# EAGLE design 3.3V_StepDown (EAGLE 9.5.1)
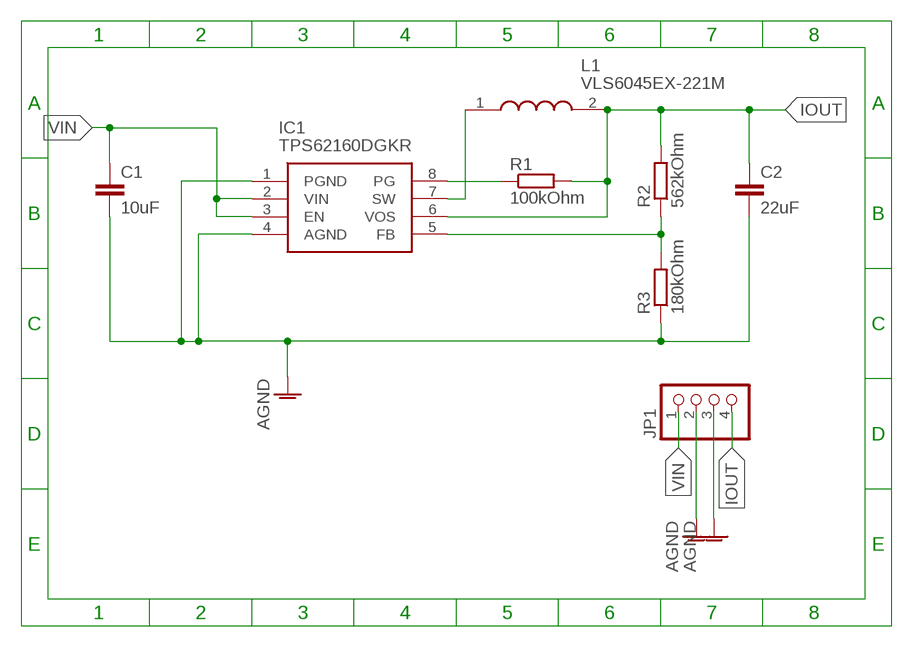
[diagram p0: schematic, sheet 1]

## Parts
C1  10uF  CNC5L1X7R1C106K160AEC1206  [C1206]
C2  22uF  GRM219R61C226ME15KC0805K  [C0805K]
IC1  TPS62160DGKR  [SOP65P490X110-8N]
JP1  PINHD-1X4  [1X04]
L1  VLS6045EX-221M  [INDPM6060X450N]
R1  100kOhm  RCS1206100KJNEAR1206  [R1206]
R2  562kOhm  ERJ-PB6B5623VR0805  [R0805]
R3  180kOhm  RN73R1ETTP1803D25R0402  [R0402]

## Nets
AGND: C1.2 C2.2 IC1.1(PGND) IC1.4(AGND) JP1.2 JP1.3 R3.1
FB2: IC1.5(FB) R2.1 R3.2
IOUT: C2.1 IC1.6(VOS) JP1.4 L1.2 R1.2 R2.2
PG2: IC1.8(PG) R1.1
SW2: IC1.7(SW) L1.1
VIN: C1.1 IC1.2(VIN) IC1.3(EN) JP1.1

## Library data of the parts
C1 = MouserUseful:CNC5L1X7R1C106K160AE: CAPACITOR, European symbol; MAX: 16V; SPICEPREFIX: C
C2 = MouserUseful:GRM219R61C226ME15K: CAPACITOR, European symbol; MAXV: 16V; SPICEPREFIX: C
IC1 = MouserUseful:TPS62160DGKR: Switching Voltage Regulators 3V-17V 1A Step-Down Converter Source: Datasheet <http://www.ti.com/lit/ds/symlink/tps62160.pdf>; DESCRIPTION: Switching Voltage Regulators 3V-17V 1A Step-Down Converter; HEIGHT: 1.1mm; MANUFACTURER_NAME: Texas Instruments; MANUFACTURER_PART_NUMBER: TPS62160DGKR; MOUSER_PART_NUMBER: 595-TPS62160DGKR; MOUSER_PRICE-STOCK: https://www.mouser.com/Search/Refine.aspx?Keyword=595-TPS62160DGKR
JP1 = pinhead:PINHD-1X4: PIN HEADER
L1 = MouserUseful:VLS6045EX-221M: Wirewound Inductor 220uH 500mA 1.15 mOhm TDK VLS-EX Series Shielded Wire-wound SMD Inductor with a Ferrite Core, 220 uH Wire-Wound 500mA Idc Source: Datasheet <https://product.tdk.com/info/en/catalog/datasheets/inductor_commercial_power_vls6045ex_en.pdf>; DESCRIPTION: Wirewound Inductor 220uH 500mA 1.15 mOhm TDK VLS-EX Series Shielded Wire-wound SMD Inductor with a Ferrite Core, 220 uH Wire-Wound 500mA Idc; HEIGHT: 4.5mm; MANUFACTURER_NAME: TDK; MANUFACTURER_PART_NUMBER: VLS6045EX-221M; MOUSER_PART_NUMBER: 810-VLS6045EX-221M; MOUSER_PRICE-STOCK: https://www.mouser.com/Search/Refine.aspx?Keyword=810-VLS6045EX-221M; RS_PART_NUMBER: 1247062; RS_PRICE-STOCK: http://uk.rs-online.com/web/p/products/1247062
R1 = MouserUseful:RCS1206100KJNEA: RESISTOR, European symbol; SPICEPREFIX: R; WATT: 0.5
R2 = MouserUseful:ERJ-PB6B5623V: RESISTOR, European symbol
R3 = MouserUseful:RN73R1ETTP1803D25: RESISTOR, European symbol; WATT: 0.5

## Board
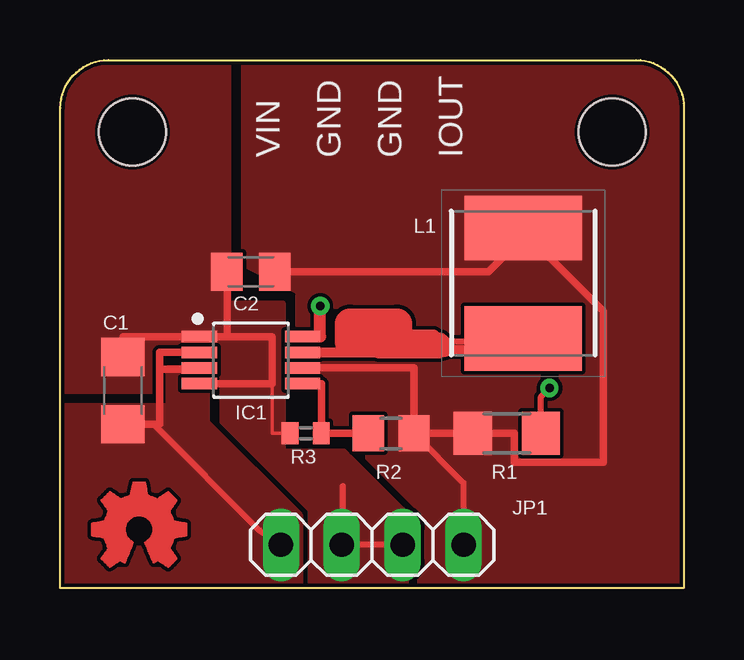
[diagram p1: board, top side]
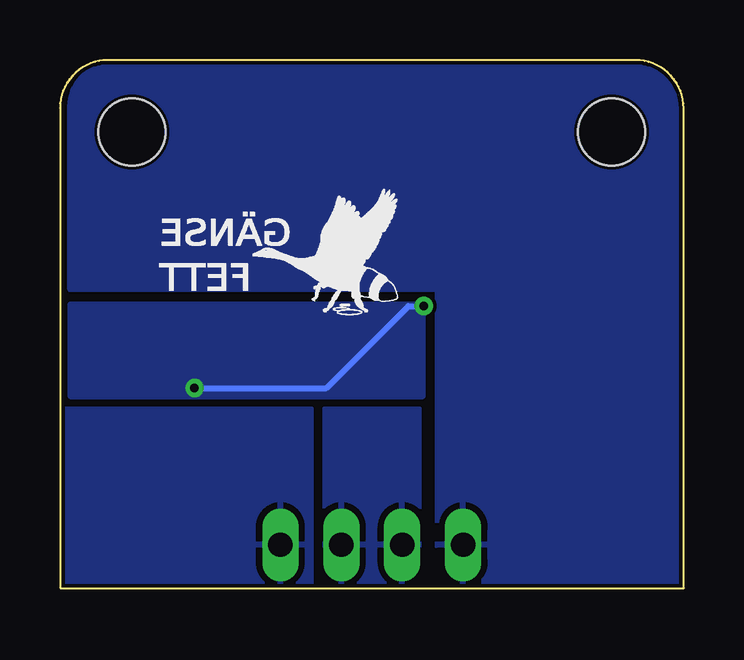
[diagram p2: board, bottom side, seen from below]

Size 26.02 x 22 mm. Coordinates in mm from the lower left corner, seen from the top.
Outline: 2.02,22 24.02,22 arc-90 26.02,20 26,0 0,0 0.02,20 arc-90 2.02,22
Copper layers (1*16): Top 0.035mm / dielectric 1.5mm / Bottom 0.035mm
Design rules "default *": minimum track width 6mil, minimum drill 0.35mm, track to track 6mil, track to pad 6mil, pad to pad 6mil, via to via 6mil, smd to smd 6mil, copper to edge 6mil, drill to drill 6mil, minimum pad ring 10mil, minimum via ring 8mil, stop-mask expansion 4mil, vias tented up to drill 0mil, thermal gap 10mil
Holes 2.8 mm at 3.02,19 23.02,19
bKeepout: area 23,15.9 to 23.2,15.9; area 19,15.9 to 19.1,15.9; area 23,15.9 to 23.2,15.9; area 19,15.9 to 19.1,16; area 22.9,15.9 to 23.1,16; area 23.1,15.9 to 23.2,16; area 19,16 to 19.1,16; area 22.9,16 to 23,16; area 23.2,16 to 23.2,16; area 19,16 to 19.1,16; area 19.3,16 to 19.3,16; area 22.8,16 to 22.9,16; 2280 more areas

### Footprints (pad centres in the part's own frame; a part is rotated, then mirrored left to right if it is on the bottom)
C1206 = smd 1.6 x 1.8: 1 -1.4,0; 2 1.4,0
C0805K = smd 1.3 x 1.6: 1 -1,0; 2 1,0
SOP65P490X110-8N = smd 1.471 x 0.481: 1 -2.15,0.975; 2 -2.15,0.325; 3 -2.15,-0.325; 4 -2.15,-0.975; 5 2.15,-0.975; 6 2.15,-0.325; 7 2.15,0.325; 8 2.15,0.975
1X04 = drill 1.016 long: 1 -3.81,0; 2 -1.27,0; 3 1.27,0; 4 3.81,0
INDPM6060X450N = smd 2.7 x 4.9: 1 -2.3,0; 2 2.3,0
R1206 = smd 1.6 x 1.803: 1 -1.422,0; 2 1.422,0
R0805 = smd 1.3 x 1.5: 1 -0.95,0; 2 0.95,0
R0402 = smd 0.7 x 0.9: 1 -0.65,0; 2 0.65,0

### Placement (x,y rotation side)
C1  2.63,8.22 90 top
C2  7.96,13.18 180 top
IC1  7.96,9.49 0 top
JP1  13.02,1.8 0 top
L1  19.32,12.7 90 top
R1  18.63,6.45 180 top
R2  13.8,6.45 0 top
R3  10.25,6.45 0 top

### Tracks (layer width: path | path; a pad name or v marks a point on that pad's centre or on a via)
AGND
  Top 0.152: R3.1 8.84,6.45 8.84,8.99
  Top 0.254: 11.79,4.25 11.79,1.84 JP1.2 JP1.3 | 6.96,12.67 C2.2
  Top 0.305: 6.96,10.47 IC1.1 2.63,10.47 C1.2 | 6.96,10.47 C2.2 | 6.96,10.47 8.84,10.47 8.84,8.99 8.84,8.52 IC1.4
  pour Top (no thermals): -0.18,8.22 3.9,8.22 3.9,10.13 6.76,10.13 6.76,6.96 10.44,3.27 10.44,0 14.42,0 14.42,3.1 11.84,5.68 9.3,5.68 9.3,11.85 7.03,11.85 7.03,22.49 2.02,22.49 arc90 -0.18,20.29
  pour Bottom: 11.02,7.5 15.02,7.5 15.02,0 11.02,0
FB2
  Top 0.305: R2.1 R3.2 10.9,8.52 IC1.5
IOUT
  Top 0.254: R2.2 16.83,4.37 JP1.4 | 18.82,14.13 18.82,14.2 18.82,14.7 19.32,14.7 19.49,14.7
  Top 0.305: IC1.6 14.75,9.17 R2.2 R1.2 18.95,6.45 18.95,5.24 22.66,5.24 22.66,11.53 19.49,14.7 | C2.1 17.87,13.18 18.82,14.13
  Top 0.762: L1.2 19.32,14.7 18.82,14.2
  pour Top (no thermals): 7.66,22.35 7.66,13.49 9.93,12.35 9.93,8.34 14.86,3.42 14.86,0 25.9,0 25.9,20.55 arc90 24.1,22.35
  pour Bottom: 15.52,0 15.52,7.5 26.02,7.5 26.02,0
PG2  (via drill 0.35)
  Top 0.254: IC1.8 10.85,10.47 10.85,10.48 | R1.1 20.05,7.98 v20.41,8.33
  Top 0.305: 10.5,10.47 IC1.8
  Top 0.508: 10.85,10.48 v10.85,11.75
  Bottom 0.254: v20.41,8.33 14.9,8.33 11.49,11.75 v10.85,11.75
  pour Bottom: 10.88,11.8 25.58,11.8 25.58,8 10.88,8
SW2
  Top 0.254: 10.04,9.75 12.53,9.75 | 13.3,9.82 13.3,10.26 14.06,10.26 15.82,10.26 18.82,10.26 | IC1.7 10.04,9.75 | 10.04,9.75 9.99,9.75 | 15.82,9.82 16,10 17.87,10 17.69,9.82 15.82,9.82
  Top 0.406: IC1.7 13.3,9.82
  Top 0.508: 13.3,9.82 15.82,9.82 | 14.31,10.26 15.58,10.26 15.58,10.51 14.06,10.51
  Top 0.762: L1.1 19.18,10.26 18.82,10.26 | 15.82,10.26 16,10.07 16,10
  Top 1.27: 12.09,10.26 12.09,11.02 14.06,11.02 14.06,10.51 14.06,10.26 12.28,10.26
VIN
  Top 0.152: IC1.2 4.85,9.82
  Top 0.254: 3.9,6.83 8.31,2.42 JP1.1
  Top 0.305: IC1.3 5.87,9.11 4.15,9.11 | C1.1 3.9,6.83 4.15,6.83 4.15,9.11 | IC1.2 4.15,9.82 4.15,9.11
  pour Top (no thermals): 0.02,7.59 4.53,7.59 4.53,9.18 6.12,9.18 6.12,6.94 10.01,3.05 10.01,0 0.02,0
  pour Bottom: 23.78,21.84 0.03,21.84 0.03,-0.18 10.25,-0.18 10.25,12.44 25.58,12.44 25.58,20.05 arc90
(copper drawn outside any net)
  shapes: Top area x369

### Text on the board
tNames: VIN | GND | GND | IOUT | C1